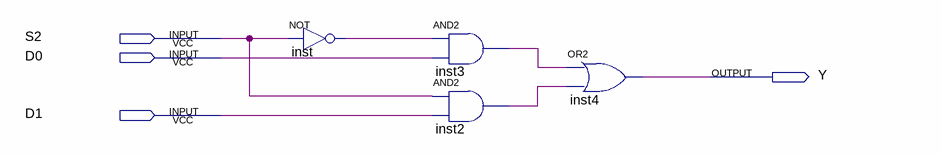
[diagram p0: schematic sheet]
// Quartus schematic MUX21.bdf as structural Verilog: 4 symbols, 4 pins
module MUX21 (
  input  S2,
  input  D0,
  input  D1,
  output Y
);

  wire inst2_out, inst3_out, inst_out;

  not inst (inst_out, S2);
  and inst3 (inst3_out, inst_out, D0);
  and inst2 (inst2_out, S2, D1);
  or inst4 (Y, inst3_out, inst2_out);
endmodule
